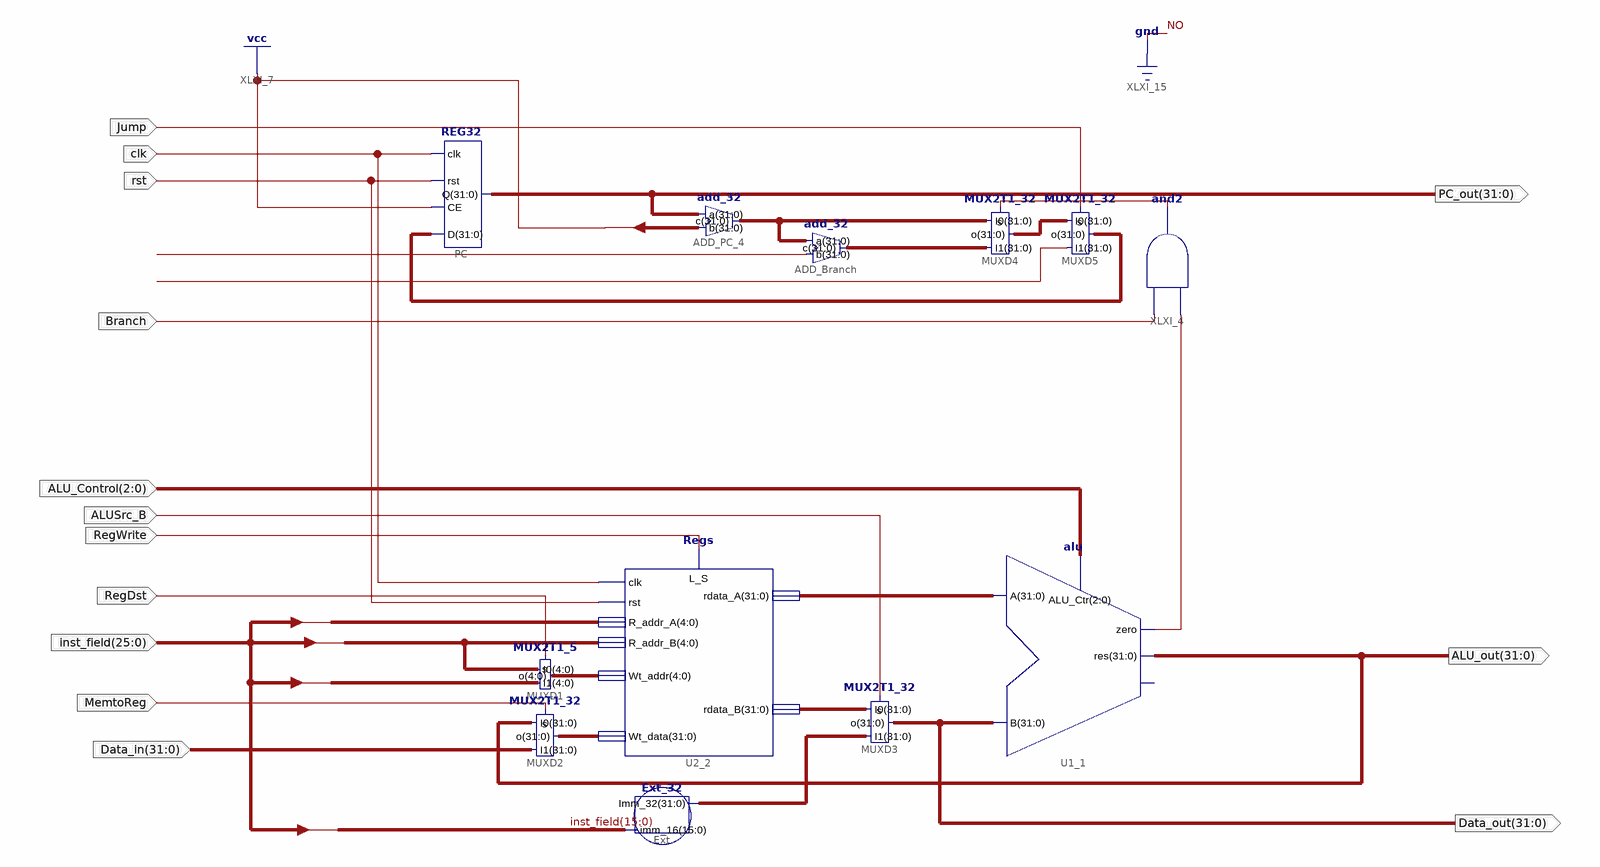
[diagram p0: schematic sheet 1]
// Xilinx ISE schematic SDPath.sch (kintex7) as structural Verilog: 12 symbols, 14 ports
module SDPath (
  input  MemtoReg,
  input  RegDst,
  input  RegWrite,
  input  ALUSrc_B,
  input  [2:0] ALU_Control,
  input  clk,
  input  rst,
  input  Branch,
  input  Jump,
  input  [25:0] inst_field,
  input  [31:0] Data_in,
  output [31:0] Data_out,
  output [31:0] ALU_out,
  output [31:0] PC_out
);

  wire Branch_offset, Jump_addr, XLXN_58, XLXN_86;
  wire [4:0] XLXN_4;
  wire [31:0] b, XLXN_1, XLXN_2, XLXN_5, XLXN_78, XLXN_84, XLXN_85, XLXN_89, XLXN_149;

  alu U1_1 (.ALU_Ctr(ALU_Control), .res(ALU_out), .zero(XLXN_58), .A(XLXN_1), .B(Data_out));  // open: overflow
  Regs #(.VeriModel("Regs")) U2_2 (
    .clk(clk), .L_S(RegWrite), .rdata_A(XLXN_1), .rst(rst), .Wt_data(XLXN_5), .rdata_B(XLXN_2),
    .R_addr_A(inst_field[25:21]), .R_addr_B(inst_field[20:16]), .Wt_addr(XLXN_4));
  MUX2T1_32 MUXD3 (.s(ALUSrc_B), .I0(XLXN_2), .I1(XLXN_149), .o(Data_out));
  Ext_32 Ext (.imm_16(inst_field[15:0]), .Imm_32(XLXN_149));
  MUX2T1_5 MUXD1 (.I1(inst_field[15:11]), .I0(inst_field[20:16]), .o(XLXN_4), .s(RegDst));
  MUX2T1_32 MUXD2 (.s(MemtoReg), .I0(ALU_out), .I1(Data_in), .o(XLXN_5));
  and XLXI_4 (XLXN_86, XLXN_58, Branch);
  REG32 PC (.D(XLXN_89), .CE(1'b1), .rst(rst), .clk(clk), .Q(PC_out));
  add_32 ADD_PC_4 (.b({b[31:3], 1'b1, b[1:0]}), .a(PC_out), .c(XLXN_78));
  add_32 ADD_Branch (.b({32{Branch_offset}}), .a(XLXN_78), .c(XLXN_84));
  MUX2T1_32 MUXD4 (.s(XLXN_86), .I0(XLXN_78), .I1(XLXN_84), .o(XLXN_85));
  MUX2T1_32 MUXD5 (.s(Jump), .I0(XLXN_85), .I1({32{Jump_addr}}), .o(XLXN_89));
endmodule
